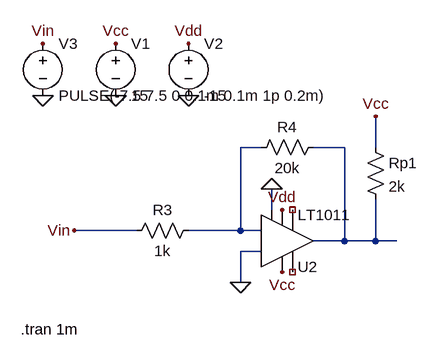
[diagram p0: schematic Draft2.asc]
Draft2.asc, the LTspice schematic file:
Version 4
SHEET 1 880 680
WIRE 368 80 336 80
WIRE 496 80 448 80
WIRE 544 80 544 32
WIRE 384 176 384 144
WIRE 176 208 80 208
WIRE 336 208 336 80
WIRE 336 208 256 208
WIRE 368 208 336 208
WIRE 496 224 496 80
WIRE 496 224 448 224
WIRE 544 224 544 160
WIRE 544 224 496 224
WIRE 576 224 544 224
WIRE 368 240 336 240
WIRE 336 288 336 240
FLAG 144 -80 Vcc
FLAG 256 -80 Vdd
FLAG 144 0 0
FLAG 256 0 0
FLAG 384 144 0
FLAG 336 288 0
FLAG 400 272 Vcc
FLAG 544 32 Vcc
FLAG 400 176 Vdd
FLAG 32 0 0
FLAG 32 -80 Vin
FLAG 80 208 Vin
SYMBOL voltage 144 -96 R0
WINDOW 123 0 0 Left 0
WINDOW 39 0 0 Left 0
SYMATTR InstName V1
SYMATTR Value 15
SYMBOL voltage 256 -96 R0
WINDOW 123 0 0 Left 0
WINDOW 39 0 0 Left 0
SYMATTR InstName V2
SYMATTR Value -15
SYMBOL res 272 192 R90
WINDOW 0 0 56 VBottom 2
WINDOW 3 32 56 VTop 2
SYMATTR InstName R3
SYMATTR Value 1k
SYMBOL res 464 64 R90
WINDOW 0 0 56 VBottom 2
WINDOW 3 32 56 VTop 2
SYMATTR InstName R4
SYMATTR Value 20k
SYMBOL Comparators\\LT1011 400 224 M180
SYMATTR InstName U2
SYMBOL res 528 64 R0
SYMATTR InstName Rp1
SYMATTR Value 2k
SYMBOL voltage 32 -96 R0
WINDOW 123 0 0 Left 0
WINDOW 39 0 0 Left 0
SYMATTR InstName V3
SYMATTR Value PULSE(-7.5 7.5 0 0.1m 0.1m 1p 0.2m)
TEXT -2 360 Left 2 !.tran 1m

The netlist it stands for:
* Draft2.asc
V1 Vcc 0 15
V2 Vdd 0 -15
R3 N001 Vin 1k
R4 N002 N001 20k
XU2 0 N001 0 Vdd NC_01 NC_02 N002 Vcc LT1011
Rp1 Vcc N002 2k
V3 Vin 0 PULSE(-7.5 7.5 0 0.1m 0.1m 1p 0.2m)
.tran 1m
.lib LTC1.lib
.backanno
.end